# EAGLE design ProdTest (EAGLE 9.4.2)
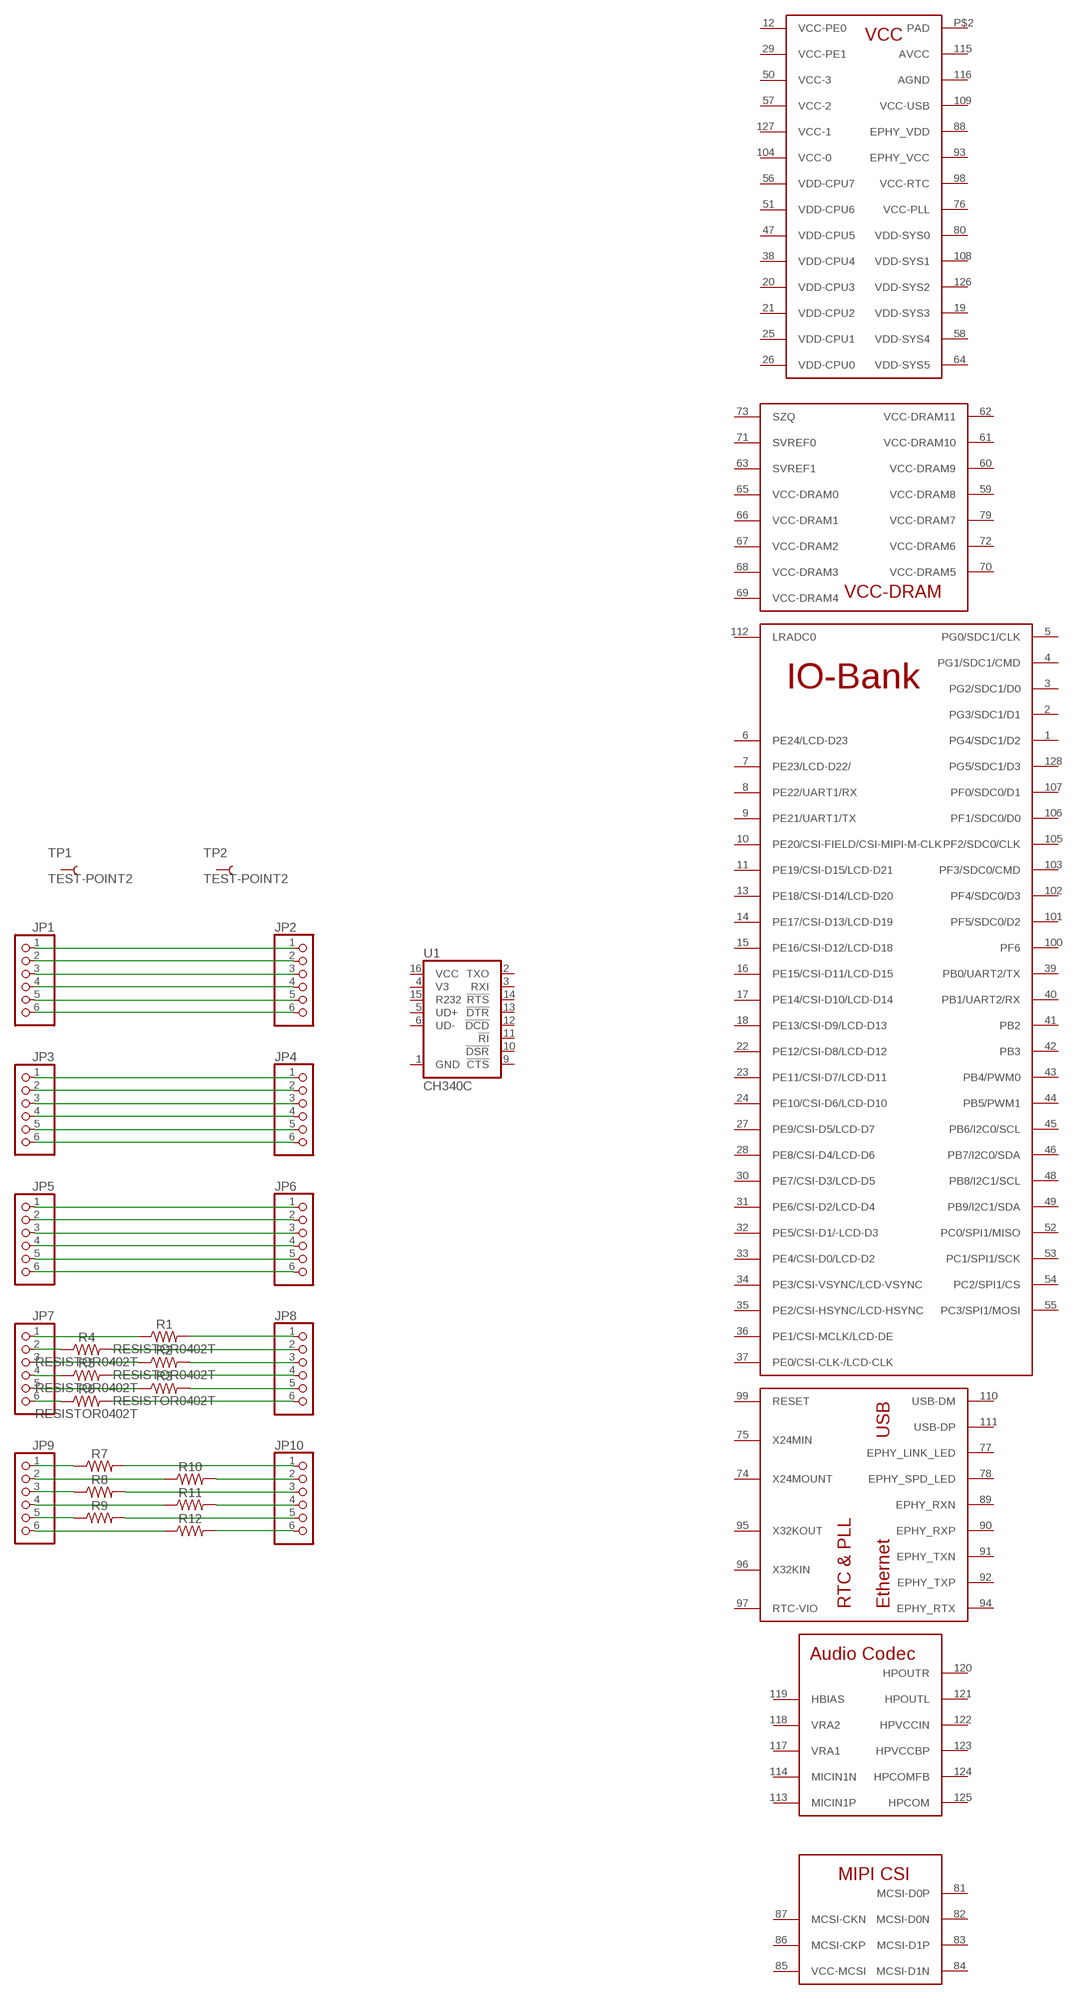
[diagram p0: schematic, sheet 1]

## Parts
JP1  PINHD-1X6  [1X06]
JP2  PINHD-1X6  [1X06]
JP3  PINHD-1X6  [1X06]
JP4  PINHD-1X6  [1X06]
JP5  PINHD-1X6  [1X06]
JP6  PINHD-1X6  [1X06]
JP7  PINHD-1X6  [1X06]
JP8  PINHD-1X6  [1X06]
JP9  PINHD-1X6  [1X06]
JP10  PINHD-1X6  [1X06]
R1  RESISTOR0402T  [0402-TIGHT]
R2  RESISTOR0402T  [0402-TIGHT]
R3  RESISTOR0402T  [0402-TIGHT]
R4  RESISTOR0402T  [0402-TIGHT]
R5  RESISTOR0402T  [0402-TIGHT]
R6  RESISTOR0402T  [0402-TIGHT]
R7  RESISTOR0603  [0603]
R8  RESISTOR0603  [0603]
R9  RESISTOR0603  [0603]
R10  RESISTOR0603  [0603]
R11  RESISTOR0603  [0603]
R12  RESISTOR0603  [0603]
TP1  TEST-POINT2  [PAD.02X.02]
TP2  TEST-POINT2  [PAD.02X.02]
U1  CH340C  [SO016]
U$1  V3S  [QFP-128]

## Nets
N$1: JP1.1 JP2.1
N$2: JP1.2 JP2.2
N$3: JP1.3 JP2.3
N$4: JP1.4 JP2.4
N$5: JP1.5 JP2.5
N$6: JP1.6 JP2.6
N$7: JP3.1 JP4.1
N$8: JP3.2 JP4.2
N$9: JP3.3 JP4.3
N$10: JP3.4 JP4.4
N$11: JP3.5 JP4.5
N$12: JP3.6 JP4.6
N$13: JP5.1 JP6.1
N$14: JP5.2 JP6.2
N$15: JP5.3 JP6.3
N$16: JP5.4 JP6.4
N$17: JP5.5 JP6.5
N$18: JP5.6 JP6.6
N$19: JP9.1 R7.1
N$20: JP9.2 R10.1
N$21: JP9.3 R8.1
N$22: JP9.4 R11.1
N$23: JP9.5 R9.1
N$24: JP9.6 R12.1
N$25: JP10.5 R9.2
N$26: JP10.6 R12.2
N$27: JP10.4 R11.2
N$28: JP10.2 R10.2
N$29: JP10.1 R7.2
N$30: JP10.3 R8.2
N$31: JP7.2 R4.1
N$32: JP7.4 R5.1
N$33: JP7.6 R6.1
N$34: JP7.5 R3.1
N$35: JP7.3 R2.1
N$36: JP7.1 R1.1
N$37: JP8.2 R4.2
N$38: JP8.1 R1.2
N$39: JP8.3 R2.2
N$40: JP8.4 R5.2
N$41: JP8.5 R3.2
N$42: JP8.6 R6.2
Unconnected: TP1.1 TP2.1 U1.1(GND) U1.2(TXO) U1.3(RXI) U1.4(V3) U1.5(UD+) U1.6(UD-) U1.9(!CTS) U1.10(!DSR) U1.11(!RI) U1.12(!DCD) U1.13(!DTR) U1.14(!RTS) U1.15(R232) U1.16(VCC) U$1.1(PG4/SDC1/D2) U$1.2(PG3/SDC1/D1) U$1.3(PG2/SDC1/D0) U$1.4(PG1/SDC1/CMD) U$1.5(PG0/SDC1/CLK) U$1.6(PE24/LCD-D23) U$1.7(PE23/LCD-D22/) U$1.8(PE22/UART1/RX) U$1.9(PE21/UART1/TX) U$1.10(PE20/CSI-FIELD/CSI-MIPI-M-CLK) U$1.11(PE19/CSI-D15/LCD-D21) U$1.12(VCC-PE0) U$1.13(PE18/CSI-D14/LCD-D20) U$1.14(PE17/CSI-D13/LCD-D19) U$1.15(PE16/CSI-D12/LCD-D18) U$1.16(PE15/CSI-D11/LCD-D15) U$1.17(PE14/CSI-D10/LCD-D14) U$1.18(PE13/CSI-D9/LCD-D13) U$1.19(VDD-SYS3) U$1.20(VDD-CPU3) U$1.21(VDD-CPU2) U$1.22(PE12/CSI-D8/LCD-D12) U$1.23(PE11/CSI-D7/LCD-D11) U$1.24(PE10/CSI-D6/LCD-D10) U$1.25(VDD-CPU1) U$1.26(VDD-CPU0) U$1.27(PE9/CSI-D5/LCD-D7) U$1.28(PE8/CSI-D4/LCD-D6) U$1.29(VCC-PE1) U$1.30(PE7/CSI-D3/LCD-D5) U$1.31(PE6/CSI-D2/LCD-D4) U$1.32(PE5/CSI-D1/-LCD-D3) U$1.33(PE4/CSI-D0/LCD-D2) U$1.34(PE3/CSI-VSYNC/LCD-VSYNC) U$1.35(PE2/CSI-HSYNC/LCD-HSYNC) U$1.36(PE1/CSI-MCLK/LCD-DE) U$1.37(PE0/CSI-CLK-/LCD-CLK) U$1.38(VDD-CPU4) U$1.39(PB0/UART2/TX) U$1.40(PB1/UART2/RX) U$1.41(PB2) U$1.42(PB3) U$1.43(PB4/PWM0) U$1.44(PB5/PWM1) U$1.45(PB6/I2C0/SCL) U$1.46(PB7/I2C0/SDA) U$1.47(VDD-CPU5) U$1.48(PB8/I2C1/SCL) U$1.49(PB9/I2C1/SDA) U$1.50(VCC-3) U$1.51(VDD-CPU6) U$1.52(PC0/SPI1/MISO) U$1.53(PC1/SPI1/SCK) U$1.54(PC2/SPI1/CS) U$1.55(PC3/SPI1/MOSI) U$1.56(VDD-CPU7) U$1.57(VCC-2) U$1.58(VDD-SYS4) U$1.59(VCC-DRAM8) U$1.60(VCC-DRAM9) U$1.61(VCC-DRAM10) U$1.62(VCC-DRAM11) U$1.63(SVREF1) U$1.64(VDD-SYS5) U$1.65(VCC-DRAM0) U$1.66(VCC-DRAM1) U$1.67(VCC-DRAM2) U$1.68(VCC-DRAM3) U$1.69(VCC-DRAM4) U$1.70(VCC-DRAM5) U$1.71(SVREF0) U$1.72(VCC-DRAM6) U$1.73(SZQ) U$1.74(X24MOUNT) U$1.75(X24MIN) U$1.76(VCC-PLL) U$1.77(EPHY_LINK_LED) U$1.78(EPHY_SPD_LED) U$1.79(VCC-DRAM7) U$1.80(VDD-SYS0) U$1.81(MCSI-D0P) U$1.82(MCSI-D0N) U$1.83(MCSI-D1P) U$1.84(MCSI-D1N) U$1.85(VCC-MCSI) U$1.86(MCSI-CKP) U$1.87(MCSI-CKN) U$1.88(EPHY_VDD) U$1.89(EPHY_RXN) U$1.90(EPHY_RXP) U$1.91(EPHY_TXN) U$1.92(EPHY_TXP) U$1.93(EPHY_VCC) U$1.94(EPHY_RTX) U$1.95(X32KOUT) U$1.96(X32KIN) U$1.97(RTC-VIO) U$1.98(VCC-RTC) U$1.99(RESET) U$1.100(PF6) U$1.101(PF5/SDC0/D2) U$1.102(PF4/SDC0/D3) U$1.103(PF3/SDC0/CMD) U$1.104(VCC-0) U$1.105(PF2/SDC0/CLK) U$1.106(PF1/SDC0/D0) U$1.107(PF0/SDC0/D1) U$1.108(VDD-SYS1) U$1.109(VCC-USB) U$1.110(USB-DM) U$1.111(USB-DP) U$1.112(LRADC0) U$1.113(MICIN1P) U$1.114(MICIN1N) U$1.115(AVCC) U$1.116(AGND) U$1.117(VRA1) U$1.118(VRA2) U$1.119(HBIAS) U$1.120(HPOUTR) U$1.121(HPOUTL) U$1.122(HPVCCIN) U$1.123(HPVCCBP) U$1.124(HPCOMFB) U$1.125(HPCOM) U$1.126(VDD-SYS2) U$1.127(VCC-1) U$1.128(PG5/SDC1/D3) U$1.P$2(PAD)

## Library data of the parts
JP1-JP10 = pinhead:PINHD-1X6: PIN HEADER
R1-R12 = SparkFun-Resistors:RESISTOR: Generic Resistor Package
TP1 TP2 = SparkFun-Connectors:TEST-POINT: SparkFun Test Points Bare copper test points for troubleshooting or In-Circuit-Testing. These are used by our Production team for verifying production board runs using pogo-pins on test beds. SparkFun Products: SparkFun LSM9DS1 Breakout <https://www.sparkfun.com/products/13284> SparkFun PSOC <https://www.sparkfun.com/products/13714> SparkFun Load Cell Amplifier <https://www.sparkfun.com/products/13879>
U1 = SparkFun-IC-Comms:CH340C; PROD_ID: IC-14038
U$1 = Allwinner V3s:V3S

## Board
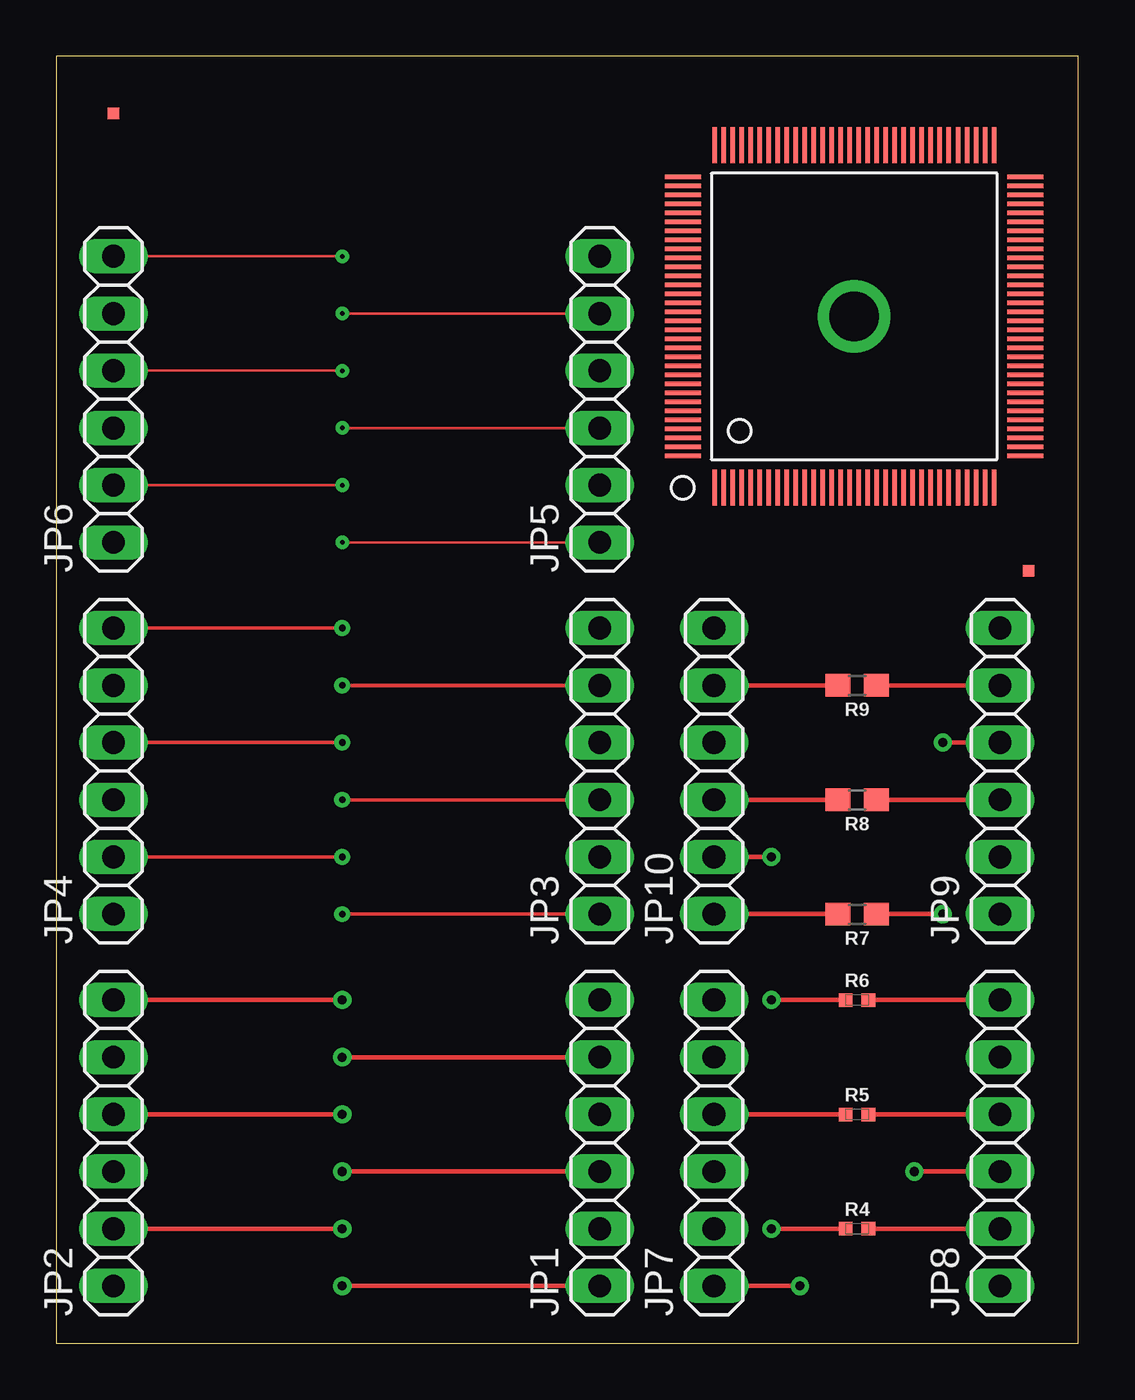
[diagram p1: board, top side]
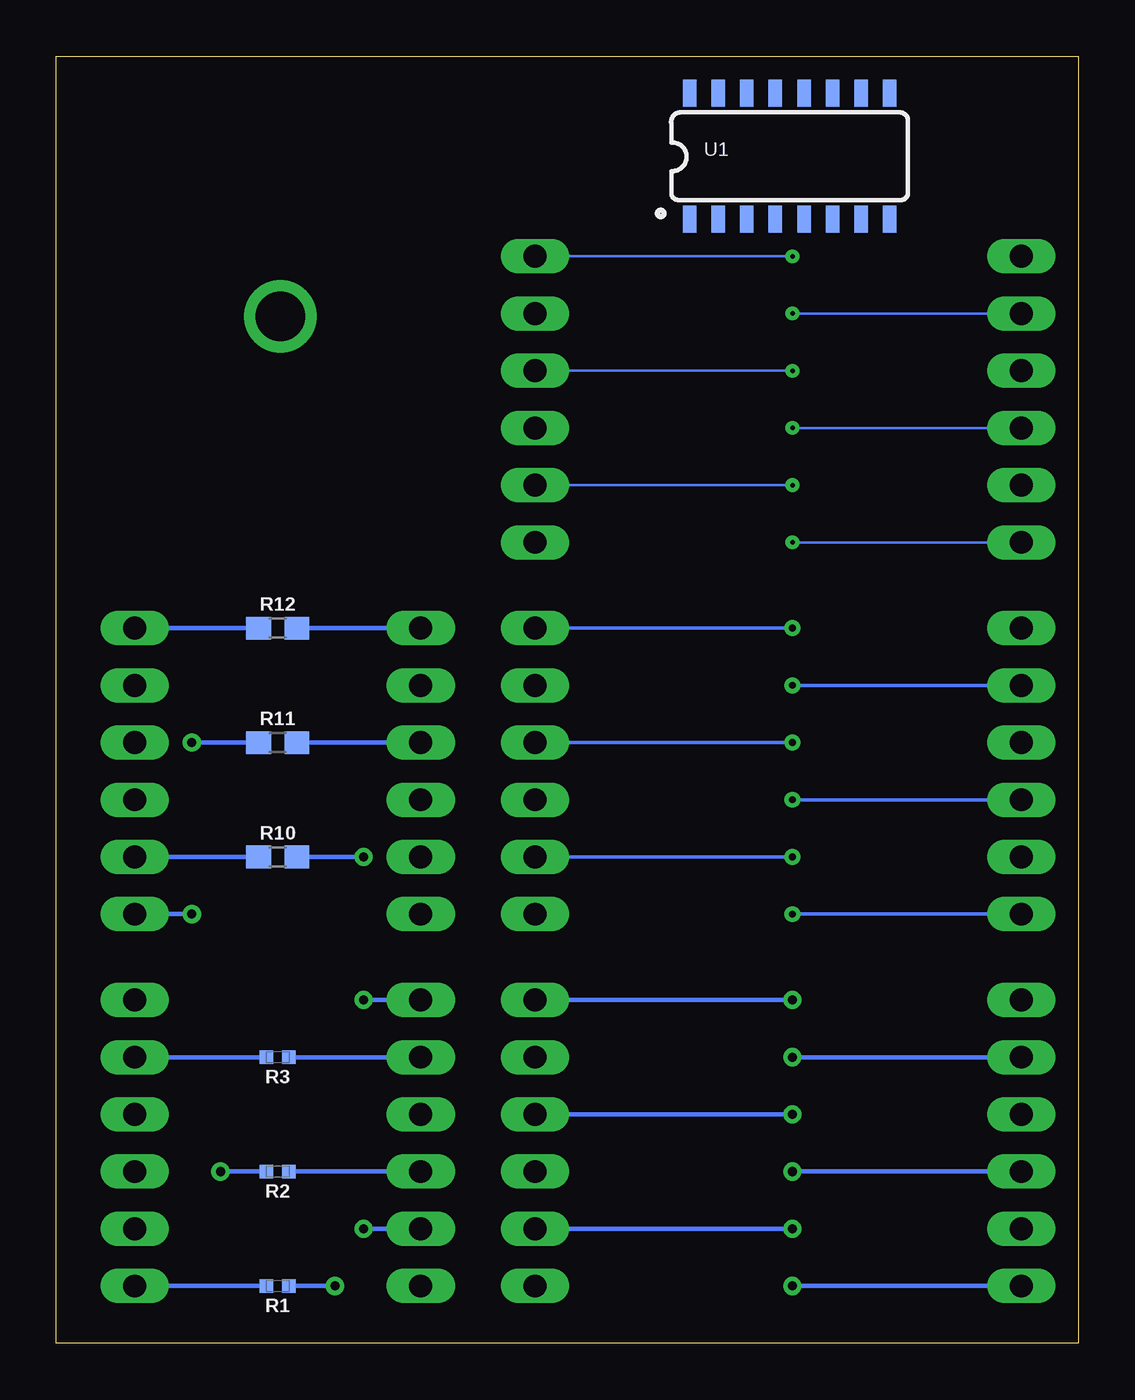
[diagram p2: board, bottom side, seen from below]

Size 45.39 x 57.14 mm. Coordinates in mm from the lower left corner, seen from the top.
Outline: 0,0 45.39,0 45.39,57.14 0,57.14 0,0
Copper layers (1*16): Top 0.035mm / dielectric 1.5mm / Bottom 0.035mm
Design rules "default": minimum track width 6mil, minimum drill 0.35mm, track to track 6mil, track to pad 6mil, pad to pad 6mil, via to via 6mil, smd to smd 6mil, copper to edge 40mil, drill to drill 6mil, minimum pad ring 10mil, minimum via ring 8mil, stop-mask expansion 4mil, vias tented up to drill 0mil, thermal gap 10mil

### Footprints (pad centres in the part's own frame; a part is rotated, then mirrored left to right if it is on the bottom)
1X06 = drill 1.016 long: 1 -6.35,0; 2 -3.81,0; 3 -1.27,0; 4 1.27,0; 5 3.81,0; 6 6.35,0
0402-TIGHT = smd 0.6 x 0.6: 1 -0.5,0; 2 0.5,0
0603 = smd 1.1 x 1: 1 -0.85,0; 2 0.85,0
PAD.02X.02 = smd 0.508 x 0.508: 1 0,0
SO016 = smd 0.6 x 1.2: 1 -4.445,-2.8; 2 -3.175,-2.8; 3 -1.905,-2.8; 4 -0.635,-2.8; 5 0.635,-2.8; 6 1.905,-2.8; 7 3.175,-2.8; 8 4.445,-2.8; 9 4.445,2.8; 10 3.175,2.8; 11 1.905,2.8; 12 0.635,2.8; 13 -0.635,2.8; 14 -1.905,2.8; 15 -3.175,2.8; 16 -4.445,2.8
QFP-128 = smd 0.2 x 1.6: 1 -6.2,-7.6; 2 -5.8,-7.6; 3 -5.4,-7.6; 4 -5,-7.6; 5 -4.6,-7.6; 6 -4.2,-7.6; 7 -3.8,-7.6; 8 -3.4,-7.6; 9 -3,-7.6; 10 -2.6,-7.6; 11 -2.2,-7.6; 12 -1.8,-7.6; 13 -1.4,-7.6; 14 -1,-7.6; 15 -0.6,-7.6; 16 -0.2,-7.6; 17 0.2,-7.6; 18 0.6,-7.6; 19 1,-7.6; 20 1.4,-7.6; 21 1.8,-7.6; 22 2.2,-7.6; 23 2.6,-7.6; 24 3,-7.6; 25 3.4,-7.6; 26 3.8,-7.6; 27 4.2,-7.6; 28 4.6,-7.6; 29 5,-7.6; 30 5.4,-7.6; 31 5.8,-7.6; 32 6.2,-7.6; 65 6.2,7.6; 66 5.8,7.6; 67 5.4,7.6; 68 5,7.6; 69 4.6,7.6; 70 4.2,7.6; 71 3.8,7.6; 72 3.4,7.6; 73 3,7.6; 74 2.6,7.6; 75 2.2,7.6; 76 1.8,7.6; 77 1.4,7.6; 78 1,7.6; 79 0.6,7.6; 80 0.2,7.6; 81 -0.2,7.6; 82 -0.6,7.6; 83 -1,7.6; 84 -1.4,7.6; 85 -1.8,7.6; 86 -2.2,7.6; 87 -2.6,7.6; 88 -3,7.6; 89 -3.4,7.6; 90 -3.8,7.6; 91 -4.2,7.6; 92 -4.6,7.6; 93 -5,7.6; 94 -5.4,7.6; 95 -5.8,7.6; 96 -6.2,7.6 | smd 1.6 x 0.2: 33 7.6,-6.2; 34 7.6,-5.8; 35 7.6,-5.4; 36 7.6,-5; 37 7.6,-4.6; 38 7.6,-4.2; 39 7.6,-3.8; 40 7.6,-3.4; 41 7.6,-3; 42 7.6,-2.6; 43 7.6,-2.2; 44 7.6,-1.8; 45 7.6,-1.4; 46 7.6,-1; 47 7.6,-0.6; 48 7.6,-0.2; 49 7.6,0.2; 50 7.6,0.6; 51 7.6,1; 52 7.6,1.4; 53 7.6,1.8; 54 7.6,2.2; 55 7.6,2.6; 56 7.6,3; 57 7.6,3.4; 58 7.6,3.8; 59 7.6,4.2; 60 7.6,4.6; 61 7.6,5; 62 7.6,5.4; 63 7.6,5.8; 64 7.6,6.2; 97 -7.6,6.2; 98 -7.6,5.8; 99 -7.6,5.4; 100 -7.6,5; 101 -7.6,4.6; 102 -7.6,4.2; 103 -7.6,3.8; 104 -7.6,3.4; 105 -7.6,3; 106 -7.6,2.6; 107 -7.6,2.2; 108 -7.6,1.8; 109 -7.6,1.4; 110 -7.6,1; 111 -7.6,0.6; 112 -7.6,0.2; 113 -7.6,-0.2; 114 -7.6,-0.6; 115 -7.6,-1; 116 -7.6,-1.4; 117 -7.6,-1.8; 118 -7.6,-2.2; 119 -7.6,-2.6; 120 -7.6,-3; 121 -7.6,-3.4; 122 -7.6,-3.8; 123 -7.6,-4.2; 124 -7.6,-4.6; 125 -7.6,-5; 126 -7.6,-5.4; 127 -7.6,-5.8; 128 -7.6,-6.2 | drill 2.2: P$2 0,0

### Placement (x,y rotation side)
JP1  24.13,8.89 90 top
JP2  2.54,8.89 90 top
JP3  24.13,25.4 90 top
JP4  2.54,25.4 90 top
JP5  24.13,41.91 90 top
JP6  2.54,41.91 90 top
JP7  29.21,8.89 90 top
JP8  41.91,8.89 90 top
JP9  41.91,25.4 90 top
JP10  29.21,25.4 90 top
R1  35.56,2.54 180 bottom
R2  35.56,7.62 180 bottom
R3  35.56,12.7 180 bottom
R4  35.56,5.08 0 top
R5  35.56,10.16 0 top
R6  35.56,15.24 0 top
R7  35.56,19.05 180 top
R8  35.56,24.13 180 top
R9  35.56,29.21 180 top
R10  35.56,21.59 0 bottom
R11  35.56,26.67 0 bottom
R12  35.56,31.75 0 bottom
TP1  2.54,54.61 0 top
TP2  43.18,34.29 0 top
U1  12.83,52.7 0 bottom
U$1  35.43,45.59 0 top

### Tracks (layer width: path | path; a pad name or v marks a point on that pad's centre or on a via)
N$1  (via drill 0.4)
  Top 0.203: v12.7,2.54 JP1.1
  Bottom 0.203: JP2.1 v12.7,2.54
N$2  (via drill 0.4)
  Top 0.203: JP2.2 v12.7,5.08
  Bottom 0.203: v12.7,5.08 JP1.2
N$3  (via drill 0.4)
  Top 0.203: v12.7,7.62 JP1.3
  Bottom 0.203: JP2.3 v12.7,7.62
N$4  (via drill 0.4)
  Top 0.203: JP2.4 v12.7,10.16
  Bottom 0.203: v12.7,10.16 JP1.4
N$5  (via drill 0.4)
  Top 0.203: v12.7,12.7 JP1.5
  Bottom 0.203: JP2.5 v12.7,12.7
N$6  (via drill 0.4)
  Top 0.203: JP2.6 v12.7,15.24
  Bottom 0.203: v12.7,15.24 JP1.6
N$7  (via drill 0.3)
  Top 0.152: v12.7,19.05 JP3.1
  Bottom 0.152: JP4.1 v12.7,19.05
N$8  (via drill 0.3)
  Top 0.152: JP4.2 v12.7,21.59
  Bottom 0.152: v12.7,21.59 JP3.2
N$9  (via drill 0.3)
  Top 0.152: v12.7,24.13 JP3.3
  Bottom 0.152: JP4.3 v12.7,24.13
N$10  (via drill 0.3)
  Top 0.152: JP4.4 v12.7,26.67
  Bottom 0.152: v12.7,26.67 JP3.4
N$11  (via drill 0.3)
  Top 0.152: v12.7,29.21 JP3.5
  Bottom 0.152: JP4.5 v12.7,29.21
N$12  (via drill 0.3)
  Top 0.152: JP4.6 v12.7,31.75
  Bottom 0.152: v12.7,31.75 JP3.6
N$13  (via drill 0.2)
  Top 0.102: v12.7,35.56 JP5.1
  Bottom 0.102: JP6.1 v12.7,35.56
N$14  (via drill 0.2)
  Top 0.102: JP6.2 v12.7,38.1
  Bottom 0.102: v12.7,38.1 JP5.2
N$15  (via drill 0.2)
  Top 0.102: v12.7,40.64 JP5.3
  Bottom 0.102: JP6.3 v12.7,40.64
N$16  (via drill 0.2)
  Top 0.102: JP6.4 v12.7,43.18
  Bottom 0.102: v12.7,43.18 JP5.4
N$17  (via drill 0.2)
  Top 0.102: v12.7,45.72 JP5.5
  Bottom 0.102: JP6.5 v12.7,45.72
N$18  (via drill 0.2)
  Top 0.102: JP6.6 v12.7,48.26
  Bottom 0.102: v12.7,48.26 JP5.6
N$19  (via drill 0.4)
  Top 0.203: R7.1 v39.37,19.05
  Bottom 0.203: v39.37,19.05 JP9.1 43.18,19.05
N$20
  Bottom 0.203: R10.1 JP9.2
N$21
  Top 0.203: R8.1 JP9.3
N$22  (via drill 0.4)
  Top 0.203: v39.37,26.67 JP9.4
  Bottom 0.203: R11.1 v39.37,26.67
N$23
  Top 0.203: R9.1 JP9.5
N$24
  Bottom 0.203: R12.1 JP9.6
N$25
  Top 0.203: R9.2 JP10.5
N$26
  Bottom 0.203: R12.2 JP10.6
N$27
  Bottom 0.203: R11.2 JP10.4
N$28  (via drill 0.4)
  Top 0.203: v31.75,21.59 JP10.2
  Bottom 0.203: R10.2 v31.75,21.59
N$29
  Top 0.203: R7.2 JP10.1
N$30
  Top 0.203: R8.2 JP10.3
N$31  (via drill 0.4)
  Top 0.203: v31.75,5.08 R4.1
  Bottom 0.203: JP7.2 v31.75,5.08
N$32
  Top 0.203: R5.1 JP7.4
N$33  (via drill 0.4)
  Top 0.203: R6.1 v31.75,15.24
  Bottom 0.203: v31.75,15.24 JP7.6
N$34
  Bottom 0.203: R3.1 JP7.5
N$35
  Bottom 0.203: R2.1 JP7.3
N$36  (via drill 0.4)
  Top 0.203: v33.02,2.54 JP7.1
  Bottom 0.203: R1.1 v33.02,2.54
N$37
  Top 0.203: R4.2 JP8.2
N$38
  Bottom 0.203: R1.2 JP8.1
N$39  (via drill 0.4)
  Top 0.203: JP8.3 v38.1,7.62
  Bottom 0.203: v38.1,7.62 R2.2
N$40
  Top 0.203: R5.2 JP8.4
N$41
  Bottom 0.203: JP8.5 R3.2
N$42
  Top 0.203: R6.2 JP8.6